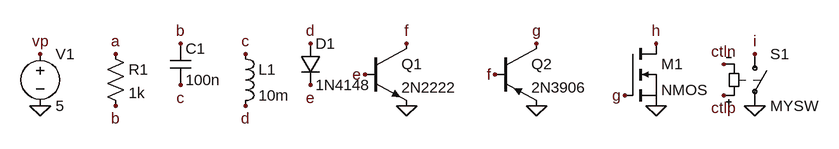
[diagram p0: schematic primitives.asc]
primitives.asc, the LTspice schematic file:
Version 4
SHEET 1 1400 680
FLAG -100 16 vp
FLAG -100 96 0
FLAG 16 16 a
FLAG 16 96 b
FLAG 116 0 b
FLAG 116 64 c
FLAG 216 16 c
FLAG 216 96 d
FLAG 316 0 d
FLAG 316 64 e
FLAG 464 0 f
FLAG 400 48 e
FLAG 464 96 0
FLAG 664 0 g
FLAG 600 48 f
FLAG 664 96 0
FLAG 848 0 h
FLAG 800 80 g
FLAG 848 96 0
FLAG 1000 16 i
FLAG 1000 96 0
FLAG 952 80 ctlp
FLAG 952 32 ctln
SYMBOL voltage -100 0 R0
SYMATTR InstName V1
SYMATTR Value 5
SYMBOL res 0 0 R0
SYMATTR InstName R1
SYMATTR Value 1k
SYMBOL cap 100 0 R0
SYMATTR InstName C1
SYMATTR Value 100n
SYMBOL ind 200 0 R0
SYMATTR InstName L1
SYMATTR Value 10m
SYMBOL diode 300 0 R0
SYMATTR InstName D1
SYMATTR Value 1N4148
SYMBOL npn 400 0 R0
SYMATTR InstName Q1
SYMATTR Value 2N2222
SYMBOL pnp 600 0 R0
SYMATTR InstName Q2
SYMATTR Value 2N3906
SYMBOL nmos 800 0 R0
SYMATTR InstName M1
SYMATTR Value NMOS
SYMBOL sw 1000 0 R0
SYMATTR InstName S1
SYMATTR Value MYSW

The netlist it stands for:
* primitives.asc
V1 vp 0 5
R1 a b 1k
C1 b c 100n
L1 c d 10m
D1 d e 1N4148
Q1 f e 0 0 2N2222
Q2 g f 0 0 2N3906
M1 h g 0 0 NMOS
S1 i 0 ctlp ctln MYSW
.model D D
.lib standard.dio
.model NPN NPN
.model PNP PNP
.lib standard.bjt
.model NMOS NMOS
.model PMOS PMOS
.lib standard.mos
.backanno
.end